# EAGLE design prog_jig_controller_v1 (EAGLE 6.4)
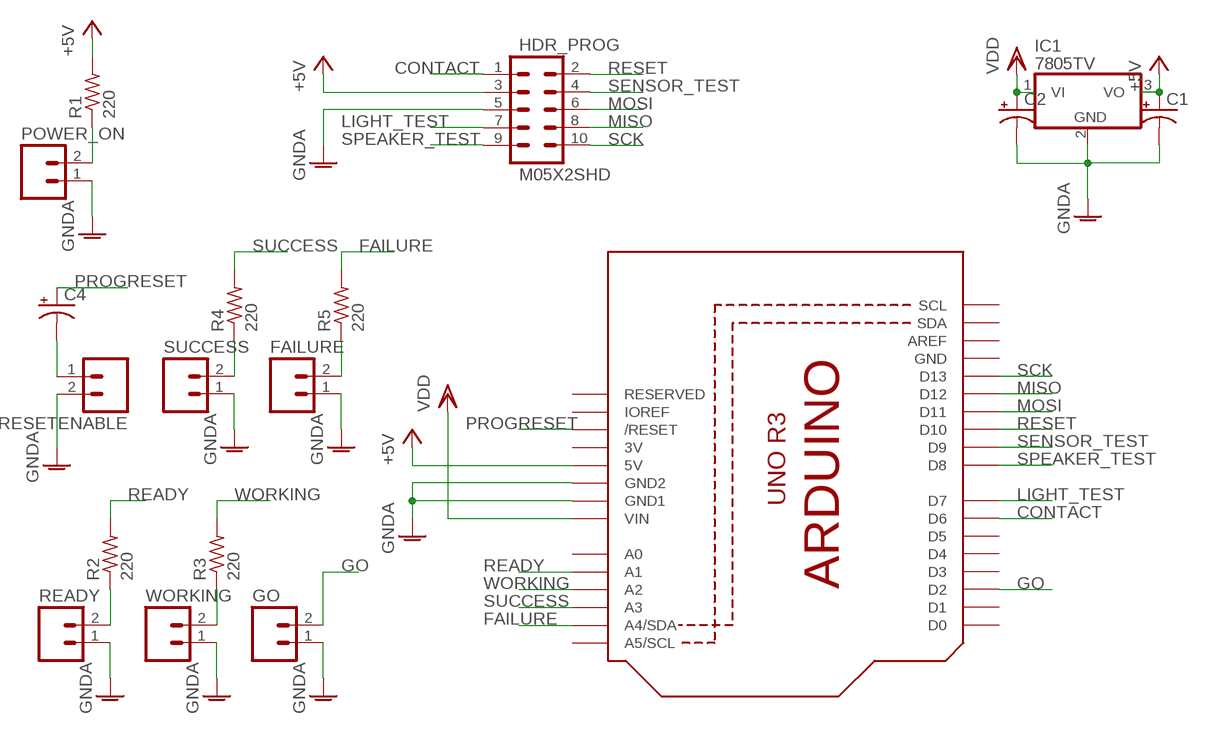
[diagram p0: schematic, sheet 1]

## Parts
C1  CAP_POLPTH2  [CPOL-RADIAL-10UF-25V]
C2  CAP_POLPTH2  [CPOL-RADIAL-10UF-25V]
C4  CAP_POLPTH2  [CPOL-RADIAL-10UF-25V]
FAILURE  M02JST-PTH-2  [JST-2-PTH]
GO  M02JST-PTH-2  [JST-2-PTH]
HDR_PROG  M05X2SHD  [2X5-SHROUDED]
IC1  7805TV  [TO220V]
POWER_ON  M02JST-PTH-2  [JST-2-PTH]
R1  220  R-US_0204/7  [0204/7]
R2  220  R-US_0204/7  [0204/7]
R3  220  R-US_0204/7  [0204/7]
R4  220  R-US_0204/7  [0204/7]
R5  220  R-US_0204/7  [0204/7]
READY  M02JST-PTH-2  [JST-2-PTH]
RESETENABLE  M02JST-PTH-2  [JST-2-PTH]
SUCCESS  M02JST-PTH-2  [JST-2-PTH]
U1  ARDUINOR3-DIMENSION  [ARDUINOR3]
WORKING  M02JST-PTH-2  [JST-2-PTH]

## Nets
+5V: C1.1(+) HDR_PROG.3 IC1.3(VO) R1.2 U1.5V
CONTACT: HDR_PROG.1 U1.D6
FAILURE: R5.2 U1.A4(A4/SDA)
GNDA: C1.2(-) C2.2(-) FAILURE.1 GO.1 HDR_PROG.5 IC1.2(GND) POWER_ON.1 READY.1 RESETENABLE.2 SUCCESS.1 U1.GND1 U1.GND2 WORKING.1
GO: GO.2 U1.D2
LIGHT_TEST: HDR_PROG.7 U1.D7
MISO: HDR_PROG.8 U1.D12
MOSI: HDR_PROG.6 U1.D11
N$1: C4.2(-) RESETENABLE.1
N$2: POWER_ON.2 R1.1
N$6: R4.1 SUCCESS.2
N$7: R3.1 WORKING.2
N$8: R2.1 READY.2
N$9: FAILURE.2 R5.1
PROGRESET: C4.1(+) U1.RESET(/RESET)
READY: R2.2 U1.A1
RESET: HDR_PROG.2 U1.D10
SCK: HDR_PROG.10 U1.D13
SENSOR_TEST: HDR_PROG.4 U1.D9
SPEAKER_TEST: HDR_PROG.9 U1.D8
SUCCESS: R4.2 U1.A3
VDD: C2.1(+) IC1.1(VI) U1.VIN
WORKING: R3.2 U1.A2
Unconnected: U1.A0 U1.A5(A5/SCL) U1.AREF U1.D0 U1.D1 U1.D3 U1.D4 U1.D5 U1.IOREF U1.RESERVED U1.SCL U1.SDA

## Power pins joined to a net without a drawn wire
3V: U1.3V
GND: U1.GND

## Library data of the parts
C1 C2 C4 = SparkFun:CAP_POL: Capacitor Polarized These are standard SMD and PTH capacitors. Normally 10uF, 47uF, and 100uF in electrolytic and tantalum varieties. Always verify the external diameter of the through hole cap, it varies with capacity, voltage, and manufacturer. The EIA devices should be standard.
FAILURE GO POWER_ON READY RESETENABLE SUCCESS WORKING = SparkFun:M02: Header 2 Standard 2-pin 0.1" header. Use with straight break away headers (SKU : PRT-00116), right angle break away headers (PRT-00553), swiss pins (PRT-00743), machine pins (PRT-00117), and female headers (PRT-00115). Molex polarized connector foot print use with SKU : PRT-08233 with associated crimp pins and housings.
HDR_PROG = SparkFun:M05X2: Header 5x2 Standard 10-pin dual row 0.1" header. Commonly used with AVR-ISP. Use with Spark Fun Electronics SKU: PRT-00778
IC1 = linear:78*: Positive VOLTAGE REGULATOR Source: http://cache.national.com/ds/LM/LM78L05.pdf http://www.fairchildsemi.com/ds/LM/LM7805.pdf
R1-R5 = rcl:R-US_: RESISTOR, American symbol
U1 = adafruit:ARDUINOR3: This is a new object for the new Arduino R3 - with extra pins that you may want to use (such as IOref, and duplicated A4/A5

## Board
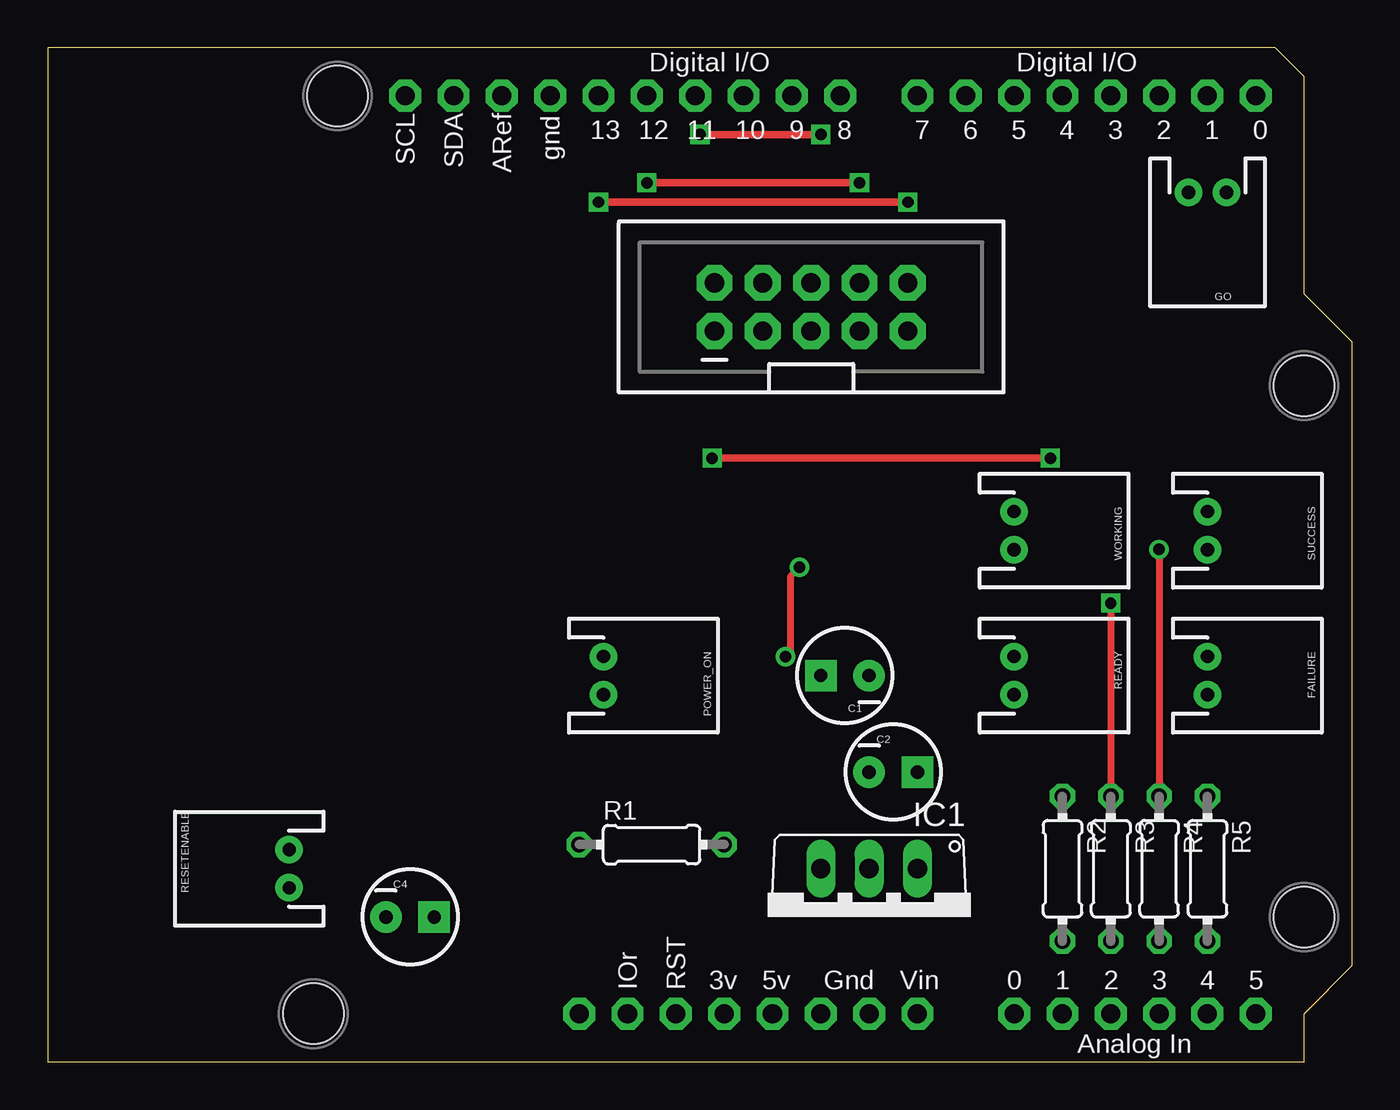
[diagram p1: board, top side]
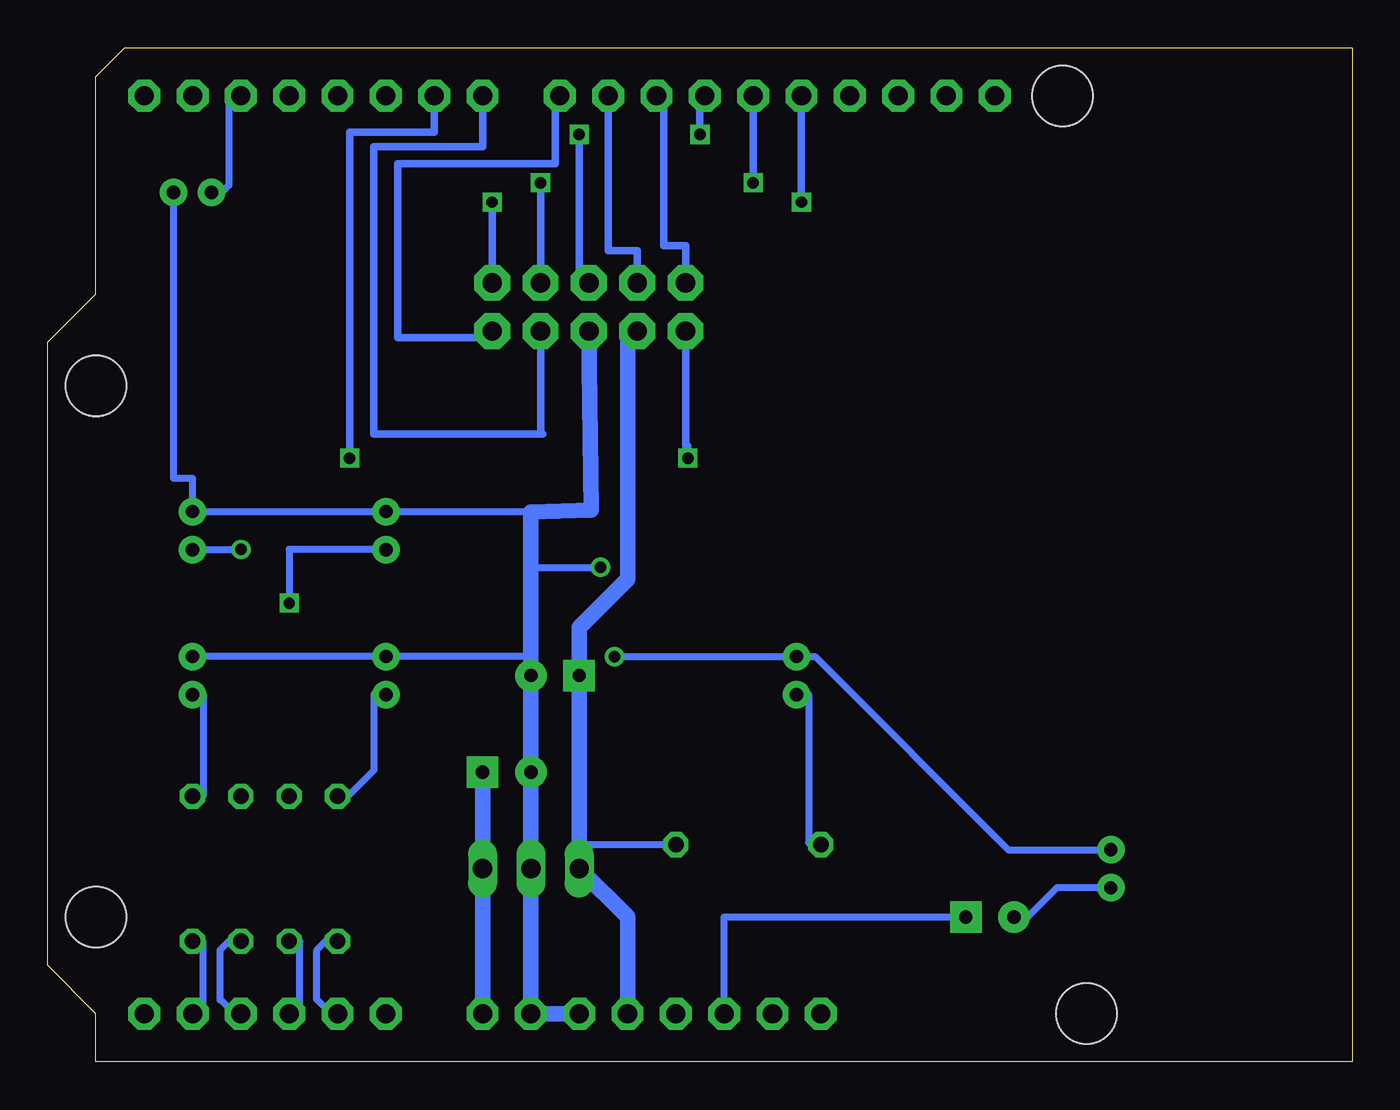
[diagram p2: board, bottom side, seen from below]

Size 68.58 x 53.34 mm. Coordinates in mm from the lower left corner, seen from the top.
Copper layers (1*16): Top 0.035mm / dielectric 1.5mm / Bottom 0.035mm
Design rules "default *": minimum track width 15mil, minimum drill 24mil, track to track 20mil, track to pad 20mil, pad to pad 20mil, via to via 20mil, smd to smd 20mil, copper to edge 40mil, drill to drill 8mil, minimum pad ring 10mil, minimum via ring 8mil, stop-mask expansion 4mil, vias tented up to drill 0mil, thermal gap 10mil
Holes 3.17 mm at 15.24,50.8 66.04,7.62 66.04,35.56 13.97,2.54

### Footprints (pad centres in the part's own frame; a part is rotated, then mirrored left to right if it is on the bottom)
CPOL-RADIAL-10UF-25V = drill 0.7 pad 1.651 square: 1 1.27,0 | drill 0.7 pad 1.651: 2 -1.27,0
JST-2-PTH = drill 0.7 pad 1.448: 1 -1,0; 2 1,0
2X5-SHROUDED = drill 1.016 pad 1.88 octagon: 1 -1.27,5.08; 2 1.27,5.08; 3 -1.27,2.54; 4 1.27,2.54; 5 -1.27,0; 6 1.27,0; 7 -1.27,-2.54; 8 1.27,-2.54; 9 -1.27,-5.08; 10 1.27,-5.08
TO220V = drill 1.016 long: 1 -2.54,-2.54; 2 0,-2.54; 3 2.54,-2.54
0204/7 = drill 0.813 octagon: 1 -3.81,0; 2 3.81,0
ARDUINOR3 = drill 1 pad 1.676 octagon: 3V 35.56,2.54; 5V 38.1,2.54; A0 50.8,2.54; A1 53.34,2.54; A2 55.88,2.54; A3 58.42,2.54; A4 60.96,2.54; A5 63.5,2.54; AREF 23.876,50.8; D0 63.5,50.8; D1 60.96,50.8; D2 58.42,50.8; D3 55.88,50.8; D4 53.34,50.8; D5 50.8,50.8; D6 48.26,50.8; D7 45.72,50.8; D8 41.656,50.8; D9 39.116,50.8; D10 36.576,50.8; D11 34.036,50.8; D12 31.496,50.8; D13 28.956,50.8; GND 26.416,50.8; GND1 43.18,2.54; GND2 40.64,2.54; IOREF 30.48,2.54; RESERVED 27.94,2.54; RESET 33.02,2.54; SCL 18.796,50.8; SDA 21.336,50.8; VIN 45.72,2.54

### Placement (x,y rotation side)
C1  41.91,20.32 180 top
C2  44.45,15.24 0 top
C4  19.05,7.62 0 top
FAILURE  60.96,20.32 270 top
GO  60.96,45.72 180 top
HDR_PROG  40.13,39.7 90 top
IC1  43.18,7.62 180 top
POWER_ON  29.21,20.32 270 top
R1  31.75,11.43 0 top
R2  53.34,10.16 270 top
R3  55.88,10.16 270 top
R4  58.42,10.16 270 top
R5  60.96,10.16 270 top
READY  50.8,20.32 270 top
RESETENABLE  12.7,10.16 90 top
SUCCESS  60.96,27.94 270 top
U1  0,0 0 top
WORKING  50.8,27.94 270 top

### Tracks (layer width: path | path; a pad name or v marks a point on that pad's centre or on a via)
+5V
  Bottom 0.381: R1.2 40.26,11.43 IC1.3
  Bottom 0.813: U1.5V 38.1,7.62 IC1.3 C1.1 40.64,22.86 38.1,25.4 38.1,37.92 HDR_PROG.3
CONTACT  (via drill 0.6)
  Top 0.406: v52.7,31.75 v34.92,31.75
  Bottom 0.406: U1.D6 48.26,48.9 52.7,48.9 v52.7,31.75 | v34.92,31.75 34.92,32.38 35.05,32.38 HDR_PROG.1
FAILURE
  Bottom 0.381: R5.2 60.43,6.35 60.4,6.33 60.4,2.54 U1.A4
GNDA  (via drill 0.6, 0.61)
  Top 0.381: v61.95,45.72 GO.1 | v38.79,21.31 39.04,21.57 39.04,25.53 v39.52,26.01
  Bottom 0.381: RESETENABLE.2 18.09,11.15 28.25,21.31 POWER_ON.1 29.39,21.31 v38.79,21.31 | FAILURE.1 READY.1 50.62,21.31 43.18,21.31 | 43.18,28.93 WORKING.1 50.98,28.93 SUCCESS.1 60.96,30.68 61.95,30.68 v61.95,45.72 | 43.18,26.01 v39.52,26.01
  Bottom 0.813: U1.GND2 U1.GND1 IC1.2 C2.2 C1.2 43.18,21.31 43.18,26.01 43.18,28.93 40.01,29.03 HDR_PROG.5
GO
  Bottom 0.381: GO.2 59.44,45.72 59.05,46.1 59.05,50.8 U1.D2
LIGHT_TEST
  Bottom 0.406: U1.D7 45.72,48.13 51.44,48.13 51.44,33.02 42.67,33.02 | 42.55,33.02 42.67,33.02 | 42.67,33.02 HDR_PROG.7
MISO  (via drill 0.6)
  Top 0.406: v31.5,46.23 v42.67,46.23
  Bottom 0.406: U1.D12 v31.5,46.23 | v42.67,46.23 HDR_PROG.8
MOSI  (via drill 0.6)
  Top 0.406: v34.29,48.77 v40.64,48.77
  Bottom 0.406: U1.D11 34.29,50.8 v34.29,48.77 | v40.64,48.77 40.64,41.27 40.13,41.27 HDR_PROG.6
N$1
  Bottom 0.381: C4.2 17.07,7.62 15.52,9.17 RESETENABLE.1
N$2
  Bottom 0.381: R1.1 28.47,11.43 28.57,11.53 28.57,19.33 POWER_ON.2
N$6  (via drill 0.61)
  Top 0.381: v58.42,26.95 R4.1
  Bottom 0.381: v58.42,26.95 SUCCESS.2
N$7  (via drill 0.6)
  Top 0.381: v55.88,24.13 R3.1
  Bottom 0.381: v55.88,24.13 55.88,26.95 WORKING.2
N$8
  Bottom 0.381: R2.1 52.81,13.97 51.44,15.34 51.44,19.33 READY.2
N$9
  Bottom 0.381: R5.1 60.43,13.97 60.4,13.99 60.4,19.33 FAILURE.2
PROGRESET
  Bottom 0.381: C4.1 33.02,7.62 U1.RESET
READY
  Bottom 0.381: R2.2 53.98,6.35 54.43,5.89 54.43,3.25 54.38,3.25 53.98,2.85 53.98,2.54 U1.A1
RESET
  Bottom 0.406: U1.D10 36.2,50.8 36.2,42.93 35.05,42.93 HDR_PROG.2
SCK  (via drill 0.6)
  Top 0.406: v28.96,45.21 v45.21,45.21
  Bottom 0.406: U1.D13 v28.96,45.21 | v45.21,45.21 HDR_PROG.10
SENSOR_TEST
  Bottom 0.406: U1.D9 39.12,42.67 37.59,42.67 HDR_PROG.4
SPEAKER_TEST
  Bottom 0.406: U1.D8 41.91,50.8 41.91,47.24 50.16,47.24 50.16,38.1 45.21,38.1 HDR_PROG.9
SUCCESS
  Bottom 0.381: R4.2 59.05,6.35 59.51,5.89 59.51,3.25 59.46,3.25 59.05,2.85 59.05,2.54 U1.A3
VDD
  Bottom 0.813: U1.VIN IC1.1 C2.1
WORKING
  Bottom 0.381: R3.2 55.35,6.35 55.32,6.33 55.32,2.54 U1.A2